# Altium schematic sheet Hg.SchDoc
size A4
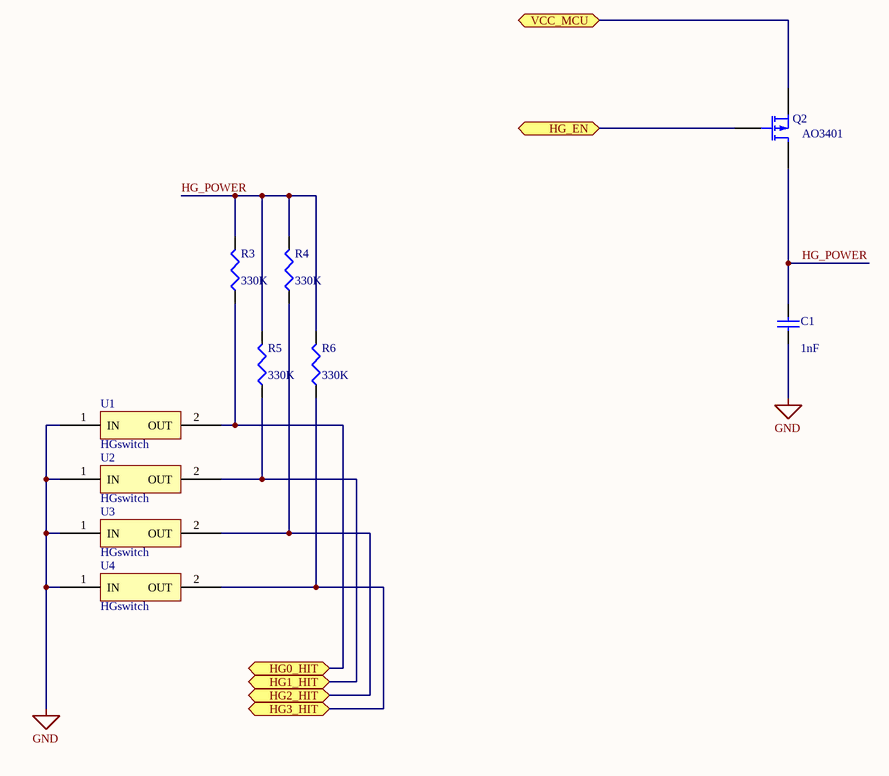
[diagram p0: Hg.SchDoc]

## Parts
C1  value 1nF  [0603]  (hidden comment: Cap Semi)
Q2  AO3401  [SOT23-3-PMOS]
R3  value 330K  [0603]  (hidden comment: Res3)
R4  value 330K  [0603]  (hidden comment: Res3)
R5  value 330K  [0603]  (hidden comment: Res3)
R6  value 330K  [0603]  (hidden comment: Res3)
U1  HGswitch  [HG-H]
U2  HGswitch  [HG-H]
U3  HGswitch  [HG-H]
U4  HGswitch  [HG-H]

## Ports
HG0_HIT (bidir), HG1_HIT (bidir), HG2_HIT (bidir), HG3_HIT (bidir), HG_EN (bidir), VCC_MCU (bidir)

## Nets
GND: C1.1 U1.1(IN) U2.1(IN) U3.1(IN) U4.1(IN)
HG0_HIT: R3.1 U1.2(OUT) ; port HG0_HIT
HG1_HIT: R5.1 U2.2(OUT) ; port HG1_HIT
HG2_HIT: R4.1 U3.2(OUT) ; port HG2_HIT
HG3_HIT: R6.1 U4.2(OUT) ; port HG3_HIT
HG_EN: Q2.2(G) ; port HG_EN
HG_POWER: C1.2 Q2.1(D) R3.2 R4.2 R5.2 R6.2
VCC_MCU: Q2.3(S) ; port VCC_MCU

## Library data of the parts
C1 = Cap Semi: Capacitor (Semiconductor SIM Model); Published: 8-Jun-2000; LatestRevisionDate: 29-May-2009; LatestRevisionNote: IPC-7351 Footprint Added.; PackageReference: C1206; Publisher: Altium Limited; PackageDescription: Chip Capacitor
Q2 = MOSFET-P: P-Channel MOSFET; Published: 8-Jun-2000; LatestRevisionDate: 17-Jul-2002; LatestRevisionNote: Re-released for DXP Platform.; PackageVersion: 1995/1996; PackageReference: E3; Publisher: Altium Limited; PackageDescription: TO, Flat Index; 3 In-Line, Axial Leads; Body Dia. 4.6mm; Lead Dia. 0.5 mm (max)
R3-R6 = Res3: Resistor; Published: 8-Jun-2000; LatestRevisionDate: 29-May-2009; LatestRevisionNote: IPC-7351 Footprint Added.; PackageReference: J1-0603; Publisher: Altium Limited; PackageDescription: Chip Resistor